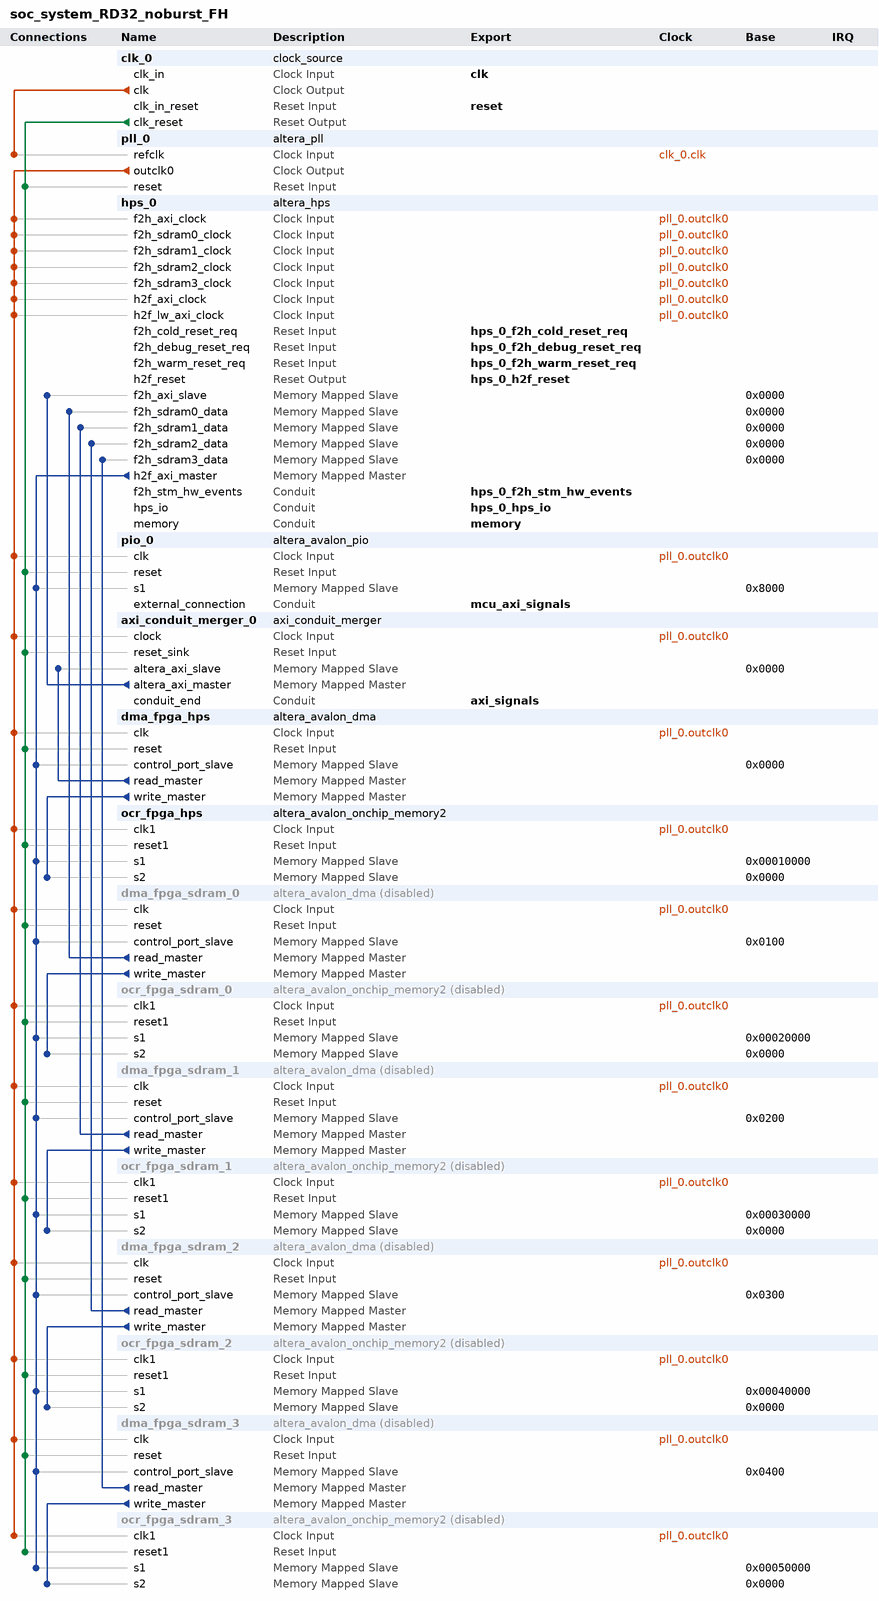
[diagram p0: system contents]
# Platform Designer (Qsys) system soc_system_RD32_noburst_FH, Cyclone V 5CSEMA5F31C6
# Parameters at their usual value, and those the tool derives, are not listed.
package require -exact qsys 16.0
create_system soc_system_RD32_noburst_FH
set_project_property DEVICE_FAMILY {Cyclone V}
set_project_property DEVICE 5CSEMA5F31C6

add_instance clk_0 clock_source 16.0
set_instance_parameter_value clk_0 clockFrequency 50000000

add_instance pll_0 altera_pll 16.0
set_instance_parameter_value pll_0 gui_device_speed_grade 2
set_instance_parameter_value pll_0 gui_number_of_clocks 1
set_instance_parameter_value pll_0 gui_operation_mode direct
set_instance_parameter_value pll_0 gui_output_clock_frequency0 50.0
set_instance_parameter_value pll_0 gui_pll_mode {Integer-N PLL}
set_instance_parameter_value pll_0 gui_reference_clock_frequency 50.0
set_instance_parameter_value pll_0 gui_use_locked false

add_instance hps_0 altera_hps 16.0
set_instance_parameter_value hps_0 EMAC1_Mode RGMII
set_instance_parameter_value hps_0 EMAC1_PinMuxing {HPS I/O Set 0}
set_instance_parameter_value hps_0 F2SCLK_COLDRST_Enable true
set_instance_parameter_value hps_0 F2SCLK_DBGRST_Enable true
set_instance_parameter_value hps_0 F2SCLK_WARMRST_Enable true
set_instance_parameter_value hps_0 F2SDRAM_Type {Avalon-MM Read-Only,Avalon-MM Read-Only,Avalon-MM Read-Only,Avalon-MM Read-Only}
set_instance_parameter_value hps_0 F2SDRAM_Width 32,32,32,32
set_instance_parameter_value hps_0 F2SINTERRUPT_Enable true
set_instance_parameter_value hps_0 F2S_Width 1
set_instance_parameter_value hps_0 FPGA_PERIPHERAL_OUTPUT_CLOCK_FREQ_EMAC0_GTX_CLK 100
set_instance_parameter_value hps_0 FPGA_PERIPHERAL_OUTPUT_CLOCK_FREQ_EMAC0_MD_CLK 100.0
set_instance_parameter_value hps_0 FPGA_PERIPHERAL_OUTPUT_CLOCK_FREQ_EMAC1_GTX_CLK 100
set_instance_parameter_value hps_0 FPGA_PERIPHERAL_OUTPUT_CLOCK_FREQ_EMAC1_MD_CLK 100.0
set_instance_parameter_value hps_0 HPS_PROTOCOL DDR3
set_instance_parameter_value hps_0 I2C0_Mode I2C
set_instance_parameter_value hps_0 I2C0_PinMuxing {HPS I/O Set 0}
set_instance_parameter_value hps_0 I2C1_Mode I2C
set_instance_parameter_value hps_0 I2C1_PinMuxing {HPS I/O Set 0}
set_instance_parameter_value hps_0 LWH2F_Enable true
set_instance_parameter_value hps_0 MEM_BANKADDR_WIDTH 3
set_instance_parameter_value hps_0 MEM_CLK_FREQ 400.0
set_instance_parameter_value hps_0 MEM_COL_ADDR_WIDTH 10
set_instance_parameter_value hps_0 MEM_DQ_WIDTH 32
set_instance_parameter_value hps_0 MEM_DRV_STR RZQ/7
set_instance_parameter_value hps_0 MEM_ROW_ADDR_WIDTH 15
set_instance_parameter_value hps_0 MEM_RTT_NOM RZQ/4
set_instance_parameter_value hps_0 MEM_RTT_WR RZQ/4
set_instance_parameter_value hps_0 MEM_TCL 11
set_instance_parameter_value hps_0 MEM_TFAW_NS 30.0
set_instance_parameter_value hps_0 MEM_TRAS_NS 35.0
set_instance_parameter_value hps_0 MEM_TRCD_NS 13.75
set_instance_parameter_value hps_0 MEM_TRFC_NS 260.0
set_instance_parameter_value hps_0 MEM_TRP_NS 13.75
set_instance_parameter_value hps_0 MEM_VENDOR JEDEC
set_instance_parameter_value hps_0 MEM_WTCL 8
set_instance_parameter_value hps_0 QSPI_Mode {1 SS}
set_instance_parameter_value hps_0 QSPI_PinMuxing {HPS I/O Set 0}
set_instance_parameter_value hps_0 REF_CLK_FREQ 25.0
set_instance_parameter_value hps_0 S2FCLK_USER0CLK_Enable true
set_instance_parameter_value hps_0 S2FCLK_USER1CLK_Enable true
set_instance_parameter_value hps_0 S2FCLK_USER2CLK 5
set_instance_parameter_value hps_0 S2F_Width 1
set_instance_parameter_value hps_0 SDIO_Mode {4-bit Data}
set_instance_parameter_value hps_0 SDIO_PinMuxing {HPS I/O Set 0}
set_instance_parameter_value hps_0 SPIM1_Mode {Single Slave Select}
set_instance_parameter_value hps_0 SPIM1_PinMuxing {HPS I/O Set 0}
set_instance_parameter_value hps_0 STM_Enable true
set_instance_parameter_value hps_0 TIMING_BOARD_AC_SKEW 0.03
set_instance_parameter_value hps_0 TIMING_BOARD_AC_TO_CK_SKEW 0.0
set_instance_parameter_value hps_0 TIMING_BOARD_DQ_TO_DQS_SKEW 0.0
set_instance_parameter_value hps_0 TIMING_BOARD_MAX_CK_DELAY 0.03
set_instance_parameter_value hps_0 TIMING_BOARD_MAX_DQS_DELAY 0.02
set_instance_parameter_value hps_0 TIMING_BOARD_SKEW_BETWEEN_DQS 0.08
set_instance_parameter_value hps_0 TIMING_BOARD_SKEW_CKDQS_DIMM_MAX 0.16
set_instance_parameter_value hps_0 TIMING_BOARD_SKEW_CKDQS_DIMM_MIN 0.09
set_instance_parameter_value hps_0 TIMING_BOARD_SKEW_WITHIN_DQS 0.01
set_instance_parameter_value hps_0 TIMING_TDH 65
set_instance_parameter_value hps_0 TIMING_TDQSCK 255
set_instance_parameter_value hps_0 TIMING_TDQSQ 125
set_instance_parameter_value hps_0 TIMING_TDS 30
set_instance_parameter_value hps_0 TIMING_TIH 140
set_instance_parameter_value hps_0 TIMING_TIS 180
set_instance_parameter_value hps_0 TIMING_TQSH 0.4
set_instance_parameter_value hps_0 UART0_Mode {No Flow Control}
set_instance_parameter_value hps_0 UART0_PinMuxing {HPS I/O Set 0}
set_instance_parameter_value hps_0 USB1_Mode SDR
set_instance_parameter_value hps_0 USB1_PinMuxing {HPS I/O Set 0}
set_instance_parameter_value hps_0 desired_cfg_clk_mhz 100.0
set_instance_parameter_value hps_0 desired_mpu_clk_mhz 925.0
set_instance_parameter_value hps_0 desired_qspi_clk_mhz 400.0
set_instance_parameter_value hps_0 use_default_mpu_clk false

add_instance pio_0 altera_avalon_pio 16.0
set_instance_parameter_value pio_0 direction InOut
set_instance_parameter_value pio_0 resetValue 252645135
set_instance_parameter_value pio_0 width 32

add_instance axi_conduit_merger_0 axi_conduit_merger 1.0
set_instance_parameter_value axi_conduit_merger_0 AXCACHE_EN 0
set_instance_parameter_value axi_conduit_merger_0 AXPROT_EN 0
set_instance_parameter_value axi_conduit_merger_0 AXUSER_EN 0
set_instance_parameter_value axi_conduit_merger_0 AXUSER_WIDTH 5
set_instance_parameter_value axi_conduit_merger_0 BUSER_EN 0
set_instance_parameter_value axi_conduit_merger_0 BUSER_WIDTH 5
set_instance_parameter_value axi_conduit_merger_0 DATA_WIDTH 32
set_instance_parameter_value axi_conduit_merger_0 ID_WIDTH 8
set_instance_parameter_value axi_conduit_merger_0 RUSER_EN 0
set_instance_parameter_value axi_conduit_merger_0 RUSER_WIDTH 5
set_instance_parameter_value axi_conduit_merger_0 WUSER_EN 0
set_instance_parameter_value axi_conduit_merger_0 WUSER_WIDTH 5

add_instance dma_fpga_hps altera_avalon_dma 16.0
set_instance_parameter_value dma_fpga_hps allowByteTransactions true
set_instance_parameter_value dma_fpga_hps allowDoubleWordTransactions true
set_instance_parameter_value dma_fpga_hps allowHalfWordTransactions true
set_instance_parameter_value dma_fpga_hps allowQuadWordTransactions true
set_instance_parameter_value dma_fpga_hps burstEnable false
set_instance_parameter_value dma_fpga_hps fifoDepth 64
set_instance_parameter_value dma_fpga_hps maxBurstSize 8
set_instance_parameter_value dma_fpga_hps minimumDmaTransactionRegisterWidth 24

add_instance ocr_fpga_hps altera_avalon_onchip_memory2 16.0
set_instance_parameter_value ocr_fpga_hps blockType M10K
set_instance_parameter_value ocr_fpga_hps dataWidth 32
set_instance_parameter_value ocr_fpga_hps dualPort true
set_instance_parameter_value ocr_fpga_hps initMemContent false
set_instance_parameter_value ocr_fpga_hps initializationFileName onchip_memory2_0
set_instance_parameter_value ocr_fpga_hps memorySize 1024
set_instance_parameter_value ocr_fpga_hps singleClockOperation true

add_instance dma_fpga_sdram_0 altera_avalon_dma 16.0
set_instance_property dma_fpga_sdram_0 ENABLED false
set_instance_parameter_value dma_fpga_sdram_0 allowByteTransactions true
set_instance_parameter_value dma_fpga_sdram_0 allowDoubleWordTransactions true
set_instance_parameter_value dma_fpga_sdram_0 allowHalfWordTransactions true
set_instance_parameter_value dma_fpga_sdram_0 allowQuadWordTransactions true
set_instance_parameter_value dma_fpga_sdram_0 burstEnable false
set_instance_parameter_value dma_fpga_sdram_0 fifoDepth 64
set_instance_parameter_value dma_fpga_sdram_0 maxBurstSize 8
set_instance_parameter_value dma_fpga_sdram_0 minimumDmaTransactionRegisterWidth 24

add_instance ocr_fpga_sdram_0 altera_avalon_onchip_memory2 16.0
set_instance_property ocr_fpga_sdram_0 ENABLED false
set_instance_parameter_value ocr_fpga_sdram_0 blockType M10K
set_instance_parameter_value ocr_fpga_sdram_0 dataWidth 32
set_instance_parameter_value ocr_fpga_sdram_0 dualPort true
set_instance_parameter_value ocr_fpga_sdram_0 initMemContent false
set_instance_parameter_value ocr_fpga_sdram_0 initializationFileName onchip_memory2_0
set_instance_parameter_value ocr_fpga_sdram_0 memorySize 1024
set_instance_parameter_value ocr_fpga_sdram_0 singleClockOperation true

add_instance dma_fpga_sdram_1 altera_avalon_dma 16.0
set_instance_property dma_fpga_sdram_1 ENABLED false
set_instance_parameter_value dma_fpga_sdram_1 allowByteTransactions true
set_instance_parameter_value dma_fpga_sdram_1 allowDoubleWordTransactions true
set_instance_parameter_value dma_fpga_sdram_1 allowHalfWordTransactions true
set_instance_parameter_value dma_fpga_sdram_1 allowQuadWordTransactions true
set_instance_parameter_value dma_fpga_sdram_1 burstEnable false
set_instance_parameter_value dma_fpga_sdram_1 fifoDepth 64
set_instance_parameter_value dma_fpga_sdram_1 maxBurstSize 8
set_instance_parameter_value dma_fpga_sdram_1 minimumDmaTransactionRegisterWidth 24

add_instance ocr_fpga_sdram_1 altera_avalon_onchip_memory2 16.0
set_instance_property ocr_fpga_sdram_1 ENABLED false
set_instance_parameter_value ocr_fpga_sdram_1 blockType M10K
set_instance_parameter_value ocr_fpga_sdram_1 dataWidth 32
set_instance_parameter_value ocr_fpga_sdram_1 dualPort true
set_instance_parameter_value ocr_fpga_sdram_1 initMemContent false
set_instance_parameter_value ocr_fpga_sdram_1 initializationFileName onchip_memory2_0
set_instance_parameter_value ocr_fpga_sdram_1 memorySize 1024
set_instance_parameter_value ocr_fpga_sdram_1 singleClockOperation true

add_instance dma_fpga_sdram_2 altera_avalon_dma 16.0
set_instance_property dma_fpga_sdram_2 ENABLED false
set_instance_parameter_value dma_fpga_sdram_2 allowByteTransactions true
set_instance_parameter_value dma_fpga_sdram_2 allowDoubleWordTransactions true
set_instance_parameter_value dma_fpga_sdram_2 allowHalfWordTransactions true
set_instance_parameter_value dma_fpga_sdram_2 allowQuadWordTransactions true
set_instance_parameter_value dma_fpga_sdram_2 burstEnable false
set_instance_parameter_value dma_fpga_sdram_2 fifoDepth 64
set_instance_parameter_value dma_fpga_sdram_2 maxBurstSize 8
set_instance_parameter_value dma_fpga_sdram_2 minimumDmaTransactionRegisterWidth 24

add_instance ocr_fpga_sdram_2 altera_avalon_onchip_memory2 16.0
set_instance_property ocr_fpga_sdram_2 ENABLED false
set_instance_parameter_value ocr_fpga_sdram_2 blockType M10K
set_instance_parameter_value ocr_fpga_sdram_2 dataWidth 32
set_instance_parameter_value ocr_fpga_sdram_2 dualPort true
set_instance_parameter_value ocr_fpga_sdram_2 initMemContent false
set_instance_parameter_value ocr_fpga_sdram_2 initializationFileName onchip_memory2_0
set_instance_parameter_value ocr_fpga_sdram_2 memorySize 1024
set_instance_parameter_value ocr_fpga_sdram_2 singleClockOperation true

add_instance dma_fpga_sdram_3 altera_avalon_dma 16.0
set_instance_property dma_fpga_sdram_3 ENABLED false
set_instance_parameter_value dma_fpga_sdram_3 allowByteTransactions true
set_instance_parameter_value dma_fpga_sdram_3 allowDoubleWordTransactions true
set_instance_parameter_value dma_fpga_sdram_3 allowHalfWordTransactions true
set_instance_parameter_value dma_fpga_sdram_3 allowQuadWordTransactions true
set_instance_parameter_value dma_fpga_sdram_3 burstEnable false
set_instance_parameter_value dma_fpga_sdram_3 fifoDepth 64
set_instance_parameter_value dma_fpga_sdram_3 maxBurstSize 8
set_instance_parameter_value dma_fpga_sdram_3 minimumDmaTransactionRegisterWidth 24

add_instance ocr_fpga_sdram_3 altera_avalon_onchip_memory2 16.0
set_instance_property ocr_fpga_sdram_3 ENABLED false
set_instance_parameter_value ocr_fpga_sdram_3 blockType M10K
set_instance_parameter_value ocr_fpga_sdram_3 dataWidth 32
set_instance_parameter_value ocr_fpga_sdram_3 dualPort true
set_instance_parameter_value ocr_fpga_sdram_3 initMemContent false
set_instance_parameter_value ocr_fpga_sdram_3 initializationFileName onchip_memory2_0
set_instance_parameter_value ocr_fpga_sdram_3 memorySize 1024
set_instance_parameter_value ocr_fpga_sdram_3 singleClockOperation true

# connections
add_connection clk_0.clk pll_0.refclk clock
add_connection pll_0.outclk0 axi_conduit_merger_0.clock clock
add_connection pll_0.outclk0 dma_fpga_hps.clk clock
add_connection pll_0.outclk0 dma_fpga_sdram_0.clk clock
add_connection pll_0.outclk0 dma_fpga_sdram_1.clk clock
add_connection pll_0.outclk0 dma_fpga_sdram_2.clk clock
add_connection pll_0.outclk0 dma_fpga_sdram_3.clk clock
add_connection pll_0.outclk0 hps_0.f2h_axi_clock clock
add_connection pll_0.outclk0 hps_0.f2h_sdram0_clock clock
add_connection pll_0.outclk0 hps_0.f2h_sdram1_clock clock
add_connection pll_0.outclk0 hps_0.f2h_sdram2_clock clock
add_connection pll_0.outclk0 hps_0.f2h_sdram3_clock clock
add_connection pll_0.outclk0 hps_0.h2f_axi_clock clock
add_connection pll_0.outclk0 hps_0.h2f_lw_axi_clock clock
add_connection pll_0.outclk0 ocr_fpga_hps.clk1 clock
add_connection pll_0.outclk0 ocr_fpga_sdram_0.clk1 clock
add_connection pll_0.outclk0 ocr_fpga_sdram_1.clk1 clock
add_connection pll_0.outclk0 ocr_fpga_sdram_2.clk1 clock
add_connection pll_0.outclk0 ocr_fpga_sdram_3.clk1 clock
add_connection pll_0.outclk0 pio_0.clk clock
add_connection clk_0.clk_reset axi_conduit_merger_0.reset_sink reset
add_connection clk_0.clk_reset dma_fpga_hps.reset reset
add_connection clk_0.clk_reset dma_fpga_sdram_0.reset reset
add_connection clk_0.clk_reset dma_fpga_sdram_1.reset reset
add_connection clk_0.clk_reset dma_fpga_sdram_2.reset reset
add_connection clk_0.clk_reset dma_fpga_sdram_3.reset reset
add_connection clk_0.clk_reset ocr_fpga_hps.reset1 reset
add_connection clk_0.clk_reset ocr_fpga_sdram_0.reset1 reset
add_connection clk_0.clk_reset ocr_fpga_sdram_1.reset1 reset
add_connection clk_0.clk_reset ocr_fpga_sdram_2.reset1 reset
add_connection clk_0.clk_reset ocr_fpga_sdram_3.reset1 reset
add_connection clk_0.clk_reset pio_0.reset reset
add_connection clk_0.clk_reset pll_0.reset reset
add_connection axi_conduit_merger_0.altera_axi_master hps_0.f2h_axi_slave avalon
set_connection_parameter_value axi_conduit_merger_0.altera_axi_master/hps_0.f2h_axi_slave baseAddress 0x0000
add_connection dma_fpga_hps.read_master axi_conduit_merger_0.altera_axi_slave avalon
set_connection_parameter_value dma_fpga_hps.read_master/axi_conduit_merger_0.altera_axi_slave baseAddress 0x0000
add_connection dma_fpga_hps.write_master ocr_fpga_hps.s2 avalon
set_connection_parameter_value dma_fpga_hps.write_master/ocr_fpga_hps.s2 baseAddress 0x0000
add_connection dma_fpga_sdram_0.read_master hps_0.f2h_sdram0_data avalon
set_connection_parameter_value dma_fpga_sdram_0.read_master/hps_0.f2h_sdram0_data baseAddress 0x0000
add_connection dma_fpga_sdram_0.write_master ocr_fpga_sdram_0.s2 avalon
set_connection_parameter_value dma_fpga_sdram_0.write_master/ocr_fpga_sdram_0.s2 baseAddress 0x0000
add_connection dma_fpga_sdram_1.read_master hps_0.f2h_sdram1_data avalon
set_connection_parameter_value dma_fpga_sdram_1.read_master/hps_0.f2h_sdram1_data baseAddress 0x0000
add_connection dma_fpga_sdram_1.write_master ocr_fpga_sdram_1.s2 avalon
set_connection_parameter_value dma_fpga_sdram_1.write_master/ocr_fpga_sdram_1.s2 baseAddress 0x0000
add_connection dma_fpga_sdram_2.read_master hps_0.f2h_sdram2_data avalon
set_connection_parameter_value dma_fpga_sdram_2.read_master/hps_0.f2h_sdram2_data baseAddress 0x0000
add_connection dma_fpga_sdram_2.write_master ocr_fpga_sdram_2.s2 avalon
set_connection_parameter_value dma_fpga_sdram_2.write_master/ocr_fpga_sdram_2.s2 baseAddress 0x0000
add_connection dma_fpga_sdram_3.read_master hps_0.f2h_sdram3_data avalon
set_connection_parameter_value dma_fpga_sdram_3.read_master/hps_0.f2h_sdram3_data baseAddress 0x0000
add_connection dma_fpga_sdram_3.write_master ocr_fpga_sdram_3.s2 avalon
set_connection_parameter_value dma_fpga_sdram_3.write_master/ocr_fpga_sdram_3.s2 baseAddress 0x0000
add_connection hps_0.h2f_axi_master dma_fpga_hps.control_port_slave avalon
set_connection_parameter_value hps_0.h2f_axi_master/dma_fpga_hps.control_port_slave baseAddress 0x0000
add_connection hps_0.h2f_axi_master dma_fpga_sdram_0.control_port_slave avalon
set_connection_parameter_value hps_0.h2f_axi_master/dma_fpga_sdram_0.control_port_slave baseAddress 0x0100
add_connection hps_0.h2f_axi_master dma_fpga_sdram_1.control_port_slave avalon
set_connection_parameter_value hps_0.h2f_axi_master/dma_fpga_sdram_1.control_port_slave baseAddress 0x0200
add_connection hps_0.h2f_axi_master dma_fpga_sdram_2.control_port_slave avalon
set_connection_parameter_value hps_0.h2f_axi_master/dma_fpga_sdram_2.control_port_slave baseAddress 0x0300
add_connection hps_0.h2f_axi_master dma_fpga_sdram_3.control_port_slave avalon
set_connection_parameter_value hps_0.h2f_axi_master/dma_fpga_sdram_3.control_port_slave baseAddress 0x0400
add_connection hps_0.h2f_axi_master ocr_fpga_hps.s1 avalon
set_connection_parameter_value hps_0.h2f_axi_master/ocr_fpga_hps.s1 baseAddress 0x00010000
add_connection hps_0.h2f_axi_master ocr_fpga_sdram_0.s1 avalon
set_connection_parameter_value hps_0.h2f_axi_master/ocr_fpga_sdram_0.s1 baseAddress 0x00020000
add_connection hps_0.h2f_axi_master ocr_fpga_sdram_1.s1 avalon
set_connection_parameter_value hps_0.h2f_axi_master/ocr_fpga_sdram_1.s1 baseAddress 0x00030000
add_connection hps_0.h2f_axi_master ocr_fpga_sdram_2.s1 avalon
set_connection_parameter_value hps_0.h2f_axi_master/ocr_fpga_sdram_2.s1 baseAddress 0x00040000
add_connection hps_0.h2f_axi_master ocr_fpga_sdram_3.s1 avalon
set_connection_parameter_value hps_0.h2f_axi_master/ocr_fpga_sdram_3.s1 baseAddress 0x00050000
add_connection hps_0.h2f_axi_master pio_0.s1 avalon
set_connection_parameter_value hps_0.h2f_axi_master/pio_0.s1 baseAddress 0x8000

# exported interfaces
add_interface axi_signals conduit end
set_interface_property axi_signals EXPORT_OF axi_conduit_merger_0.conduit_end
add_interface clk clock sink
set_interface_property clk EXPORT_OF clk_0.clk_in
add_interface hps_0_f2h_cold_reset_req reset sink
set_interface_property hps_0_f2h_cold_reset_req EXPORT_OF hps_0.f2h_cold_reset_req
add_interface hps_0_f2h_debug_reset_req reset sink
set_interface_property hps_0_f2h_debug_reset_req EXPORT_OF hps_0.f2h_debug_reset_req
add_interface hps_0_f2h_stm_hw_events conduit end
set_interface_property hps_0_f2h_stm_hw_events EXPORT_OF hps_0.f2h_stm_hw_events
add_interface hps_0_f2h_warm_reset_req reset sink
set_interface_property hps_0_f2h_warm_reset_req EXPORT_OF hps_0.f2h_warm_reset_req
add_interface hps_0_h2f_reset reset source
set_interface_property hps_0_h2f_reset EXPORT_OF hps_0.h2f_reset
add_interface hps_0_hps_io conduit end
set_interface_property hps_0_hps_io EXPORT_OF hps_0.hps_io
add_interface mcu_axi_signals conduit end
set_interface_property mcu_axi_signals EXPORT_OF pio_0.external_connection
add_interface memory conduit end
set_interface_property memory EXPORT_OF hps_0.memory
add_interface reset reset sink
set_interface_property reset EXPORT_OF clk_0.clk_in_reset

set_interconnect_requirement {$system} qsys_mm.clockCrossingAdapter HANDSHAKE
set_interconnect_requirement {$system} qsys_mm.maxAdditionalLatency 1

save_system soc_system_RD32_noburst_FH.qsys
